# Altium schematic sheet FT232.SchDoc
size A4
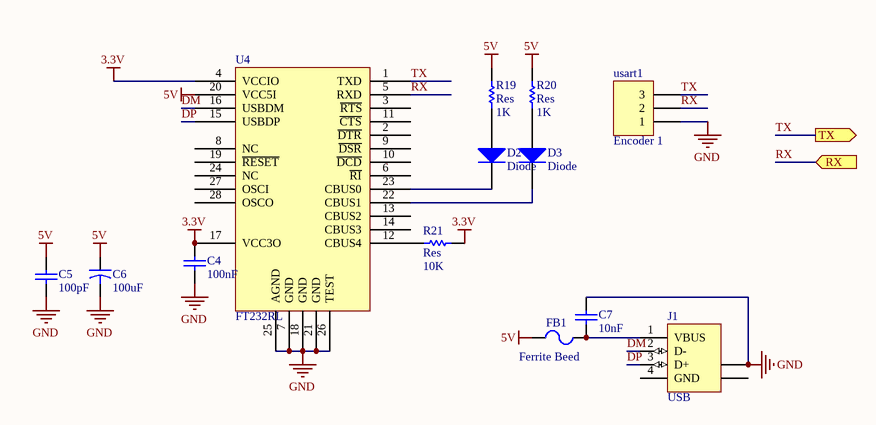
[diagram p0: FT232.SchDoc]

## Parts
C4  value 100nF  [2012[0805]]  (hidden comment: Cap_UP)
C5  value 100pF  [2012[0805]]  (hidden comment: Cap_UP)
C6  value 100uF  [7343]  (hidden comment: Cap_El)
C7  value 10nF  [2012[0805]]  (hidden comment: Cap_UP)
D2  Diode  [2012[0805]]
D3  Diode  [2012[0805]]
FB1  Ferrite Beed  [2012[0805]]
J1  USB  [USB_MINI]
R19  Res  value 1K  [2012[0805]]
R20  Res  value 1K  [2012[0805]]
R21  Res  value 10K  [2012[0805]]
U4  FT232RL  [SSOP28]
usart1  Encoder 1  [HDR1X3]

## Ports
RX (in), TX (out)

## Nets
3.3V: C4.2 R21.2 U4.4(VCCIO) U4.17(VCC3O)
5V: C5.2 C6.1 FB1.1 R19.2 R20.2 U4.20(VCC5I)
GND: C4.1 C5.1 C6.2 C7.1 J1.5(SHLD) U4.7(GND) U4.18(GND) U4.21(GND) U4.25(AGND) U4.26(TEST) usart1.1
DM: J1.2(D-) U4.16(USBDM)
DP: J1.3(D+) U4.15(USBDP)
RX: U4.5(RXD) usart1.2 ; port RX
TX: U4.1(TXD) usart1.3 ; port TX
NetC7_2: C7.2 FB1.2 J1.1(VBUS)
NetD2_1: D2.1(A) R19.1
NetD2_2: D2.2(K) U4.23(CBUS0)
NetD3_1: D3.1(A) R20.1
NetD3_2: D3.2(K) U4.22(CBUS1)
NetR21_1: R21.1 U4.12(CBUS4)

Not connected (* = marked no-connect by the designer): J1 4(GND) 6(SHLD); U4 2(~{DTR}) 3(~{RTS}) 6(~{RI}) 8(NC) 9(~{DSR}) 10(~{DCD}) 11(~{CTS}) 13(CBUS2) 14(CBUS3) 19(~{RESET}) 24(NC) 27(OSCI) 28(OSCO)

## Library data of the parts
C4 C5 C7 = Cap_UP: Capacitor; Published: 8-Jun-2000; LatestRevisionDate: 17-Jul-2002; LatestRevisionNote: Re-released for DXP Platform.; PackageReference: RAD-0.3; Publisher: Altium Limited
C6 = Cap_El: Capacitor; Published: 23-Sep-2002; PackageReference: CAPR5-4X5; Publisher: Altium Limited
D2 D3 = Diode: 1 Amp General Purpose Rectifier; Revision 1: 11-Jul-2000: SIM Model Added.; Revision 2: 17-Jul-2002: Re-released for DXP Platform.; Package Information: Latest Revision: Aug-1999; Code - JEDEC: DO-204-AL; Published: 8-Jun-2000; Datasheet: Latest Revision: 1998; Package Reference: DO-41; Publisher: Altium Limited
FB1 = Ferrite Beed: Code_IEC: 1005; Published: 8-Jun-2000; LatestRevisionDate: 17-Jul-2002; LatestRevisionNote: Re-released for DXP Platform.; PackageReference: 0402-A; Publisher: Altium Limited; Code_JEITA: 0402
J1 = USB: USB 1.1, Right Angle, Thru-Hole, A Type, Receptacle, 4 Position, Black; ContactMaterial: Copper Alloy; ContactPlating: Gold (30) over Palladium Nickel; TerminationLength: 2.84mm [0.112in.]; PCB_Layout: Complies with manufacturer's recommendation.; DrillSize: Corresponds to nominal value.; PanelGround: Without; Published: 15-Jul-2004; DatasheetDocument: 11-Jan-2004; PackageDocument: 11-Jan-2004; PackageReference: 1364372; Publisher: Altium Limited; HousingMaterial: Thermoplastic; ComponentLink1Description: Manufacturer Link; ComponentLink1URL: http://www.tycoelectronics.com/; ComponentLink2Description: Packaging Specification; ComponentLink2URL: http://ecommas.tycoelectronics.com/commerce/DocumentDelivery/DDEController?Action=showdoc&DocId=Customer+Drawing%7F1364372%7FD%7Ftif%7FEnglish%7FENG_CD_1364372_D.tif
R19-R21 = Res: Semiconductor Resistor; Published: 8-Jun-2000; LatestRevisionDate: 17-Jul-2002; LatestRevisionNote: Re-released for DXP Platform.; PackageReference: AXIAL-0.5; Publisher: Altium Limited
usart1 = Header 3: Header, 3-Pin; LatestRevisionDate: 17-Jul-2002; LatestRevisionNote: Re-released for DXP Platform.; Publisher: Altium Limited